# Altium schematic sheet Connectors.SchDoc
size A4; SheetNumber: 3; SheetTotal: 6
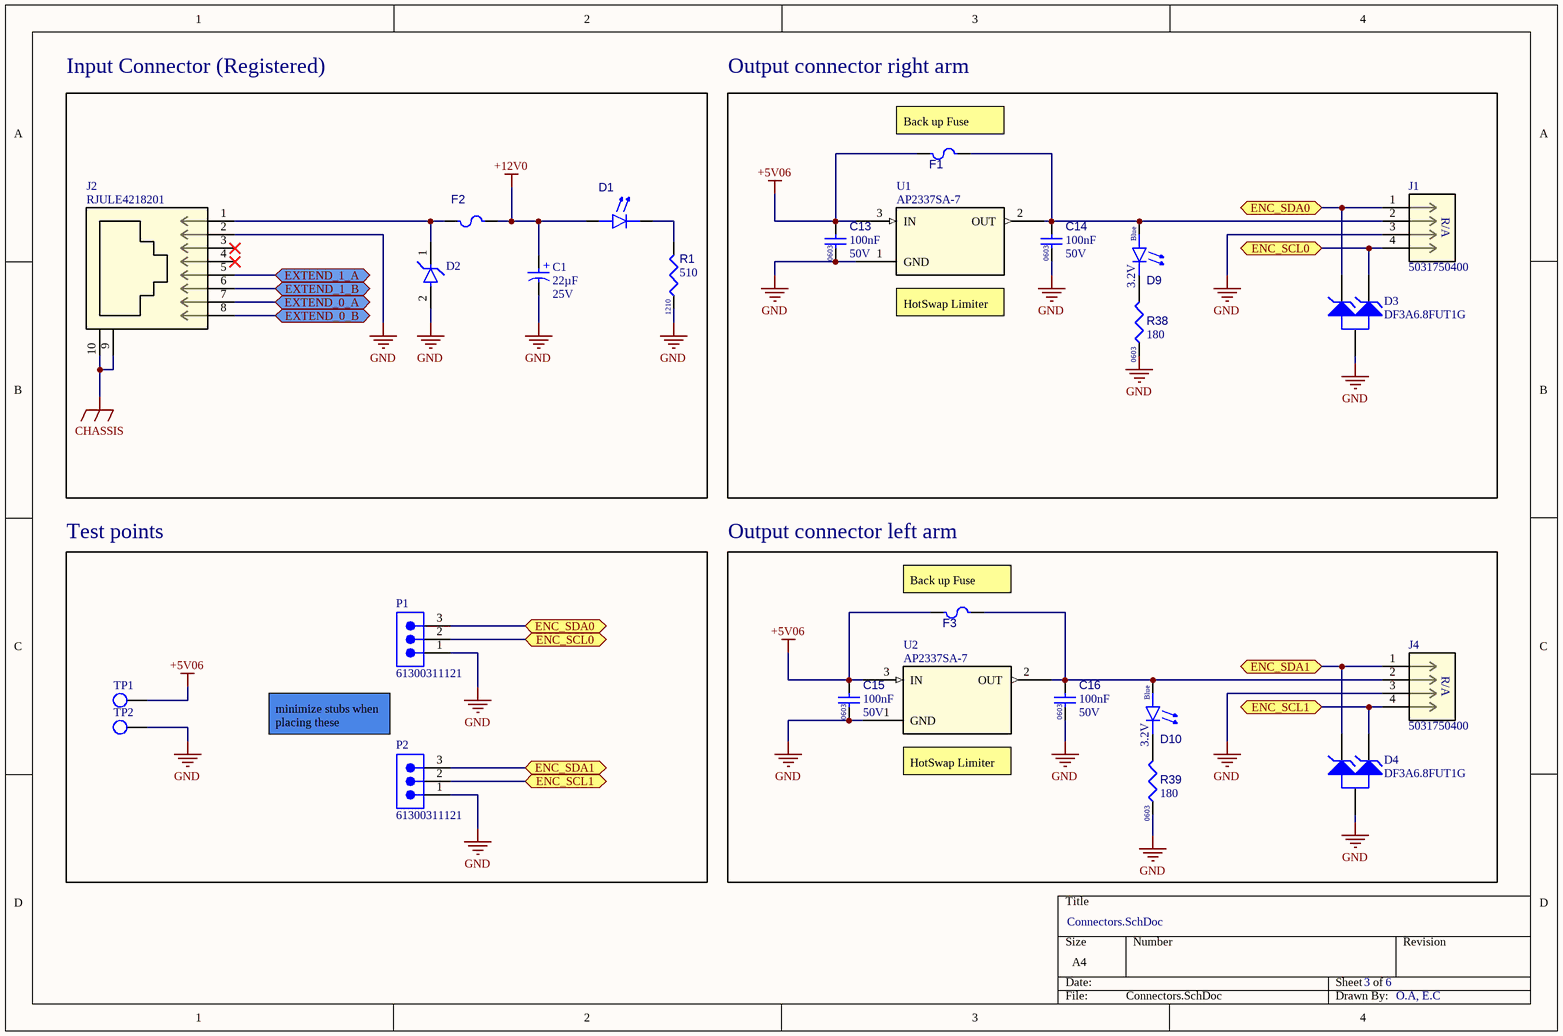
[diagram p0: Connectors.SchDoc]

## Parts
C1  value 22µF  Voltage Rating: 25V  [WCAP-PSLP_D6.3H5.8]  (hidden comment: 875105544003)
C13  value 100nF  Voltage Rating: 50V  Case/Package: 0603  [CAPC1608X90X40NL10T20]  (hidden comment: Capacitor 100 nF +/-10% 50 V 0603)
C14  value 100nF  Voltage Rating: 50V  Case/Package: 0603  [CAPC1608X90X40NL10T20]  (hidden comment: Capacitor 100 nF +/-10% 50 V 0603)
C15  value 100nF  Voltage Rating: 50V  Case/Package: 0603  [CAPC1608X90X40NL10T20]  (hidden comment: Capacitor 100 nF +/-10% 50 V 0603)
C16  value 100nF  Voltage Rating: 50V  Case/Package: 0603  [CAPC1608X90X40NL10T20]  (hidden comment: Capacitor 100 nF +/-10% 50 V 0603)
D1  150060RS75000  [WL-SMCW_0603_150060xx75000]  (value not drawn)
D2  SMAJ5.0A-13-F  [FP-SMA-MFG]  (value not drawn)
D3  DF3A6.8FUT1G  [ONSC-SC-70-3-419-04_V]
D4  DF3A6.8FUT1G  [ONSC-SC-70-3-419-04_V]
D9  Nominal Vf: 3.2V  Color: Blue  [WL-SMCW_0603_150060xx75000]  (hidden comment: 150060BS75000)
D10  Nominal Vf: 3.2V  Color: Blue  [WL-SMCW_0603_150060xx75000]  (hidden comment: 150060BS75000)
F1  MF-PSMF050X-2  [FP-MF-PSMF-MFG]  (value not drawn)
F2  MF-MSMF075-2  [BOUR-MF-MSMF050-2_V]  (value not drawn)
F3  MF-PSMF050X-2  [FP-MF-PSMF-MFG]  (value not drawn)
J1  5031750400  [5031750400-Footprint-1]
J2  RJULE4218201  [RJULE4218201-Footprint-1]
J4  5031750400  [5031750400-Footprint-1]
P1  61300311121  [61300311121]
P2  61300311121  [61300311121]
R1  value 510  Case/Package: 1210  [RESC3126X60X50NL10T20]  (hidden comment: RC1210JR-07510RL)
R38  value 180  Case/Package: 0603  [RESC0603(1608)_N]  (hidden comment: RC0603JR-07180RL)
R39  value 180  Case/Package: 0603  [RESC0603(1608)_N]  (hidden comment: RC0603JR-07180RL)
TP1  RCUCTE  [FP-S2761-46R-MFG]  (value not drawn)
TP2  RCUCTE  [FP-S2761-46R-MFG]  (value not drawn)
U1  AP2337SA-7  [SOT90P240X120-3L]
U2  AP2337SA-7  [SOT90P240X120-3L]

## Blocks framed on the sheet
Input Connector (Registered): C1 D1 D2 F2 J2 R1
Output connector right arm: C13 C14 D3 D9 F1 J1 R38 U1
Test points: P1 P2 TP1 TP2
Output connector left arm: C15 C16 D4 D10 F3 J4 R39 U2

## Ports
ENC_SCL0 (bidir), ENC_SCL1 (bidir), ENC_SDA0 (bidir), ENC_SDA1 (bidir), EXTEND_0_A (bidir), EXTEND_0_B (bidir), EXTEND_1_A (bidir), EXTEND_1_B (bidir)

## Nets
+5V06: C13.2 C15.2 F1.2 F3.2 TP1.1 U1.3(IN) U2.3(IN)
+12V0: C1.1(P) D1.2(A) F2.2
CHASSIS: J2.9 J2.10
GND: C1.2(N) C13.1 C14.1 C15.1 C16.1 D2.2(A) D3.3(A) D4.3(A) J1.3 J2.2 J4.3 P1.1 P2.1 R1.1 R38.1 R39.1 TP2.1 U1.1(GND) U2.1(GND)
ENC_SCL0: D3.2(K2) J1.4 P1.2 ; port ENC_SCL0
ENC_SCL1: D4.2(K2) J4.4 P2.2 ; port ENC_SCL1
ENC_SDA0: D3.1(K1) J1.1 P1.3 ; port ENC_SDA0
ENC_SDA1: D4.1(K1) J4.1 P2.3 ; port ENC_SDA1
EXTEND_0_A: J2.7 ; port EXTEND_0_A
EXTEND_0_B: J2.8 ; port EXTEND_0_B
EXTEND_1_A: J2.5 ; port EXTEND_1_A
EXTEND_1_B: J2.6 ; port EXTEND_1_B
NetC14_2: C14.2 D9.2(A) F1.1 J1.2 U1.2(OUT)
NetC16_2: C16.2 D10.2(A) F3.1 J4.2 U2.2(OUT)
NetD1_1: D1.1(K) R1.2
NetD2_1: D2.1(C) F2.1 J2.1
NetD9_1: D9.1(K) R38.2
NetD10_1: D10.1(K) R39.2

Not connected (* = marked no-connect by the designer): J2 3* 4*

## Notes on the sheet
- (near F1) Back up Fuse
- (near U1) HotSwap Limiter
- (near F3) Back up Fuse
- minimize stubs when placing these
- (near U2) HotSwap Limiter
- O.A, E.C
- (in symbol CMP-001-00085-2) +
- (in symbol CMP-002-00074-2) R/A

## Library data of the parts
C1 = CMP-001-00085-2: 22 µF 25 V Aluminum - Polymer Capacitors Radial, Can - SMD 30mOhm 2000 Hrs @ 105°C; Tolerance: 20%; Capacitor Type: Aluminium; Pins: 2; RoHS Compliant: Yes
C13-C16 = CMP-001-00017-8: Chip Capacitor, 100 nF, +/- 10%, 50 V, 0603 (1608 Metric); Capacitor Type: Ceramic; Tolerance: 10%; Mounting Technology: SM; Max Operating Temperature: 125°C; RoHS Compliant: True; Pins: 2; Min Operating Temperature: -55°C
D1 = CMP-007-00036-1: Single Color LED, Red, Water Clear, 1.1mm; Forward Current: 30mA; Max Operating Temperature: 85°C; Mounting Technology: Surface Mount; RoHS Compliant: Yes; Pins: 2; Min Operating Temperature: -40°C
D2 = CMP-004-00031-3: Trans Voltage Suppressor Diode, 400W, 5V V(RWM), Unidirectional, 1 Element, Silicon; RoHS Compliant: Yes; Max Operating Temperature: 150°C; Min Operating Temperature: -55°C; Pins: 2
D3 D4 = CMP-004-00039-1: Trans Voltage Suppressor Diode, 150W, Unidirectional, 2 Element, Silicon; Dynamic Impedance-Max: 50R; Time @ Peak Reflow Temperature-Max (s): 40s; Test Current: 5mA; Max Power Dissipation: 200mW; Package Body Material: Plastic; Number of Elements: 2; Voltage Tol-Max: 5.9%; Max Breakdown Voltage: 7.2V; Qualification Status: Not Qualified; Min Breakdown Voltage: 6.4V; Reference Voltage-Nom: 6.8V; Terminal Form: Gull Wing; Reach SVHC Compliant: Yes; Package Shape: Rectangular; Terminal Finish: Tin; Terminal Position: DUAL; JESD-609 Code: e3; Non-rep Peak Rev Power Dis-Max: 150W; Surface Mount: Yes; Diode Type: TRANS VOLTAGE SUPPRESSOR; Technology: ZENER; Polarity: Unidirectional; Max Operating Temperature: 150°C; Moisture Sensitivity Level: 1; Diode Element Material: SILICON; Min Operating Temperature: -55°C; Package Style: SMALL OUTLINEMeter; Pins: 3; Peak Reflow Temperature (Cel): 260°C; JESD-30 Code: R-PDSO-G3; RoHS Compliant: Yes
D9 D10 = CMP-007-00037-2: Single Color LED, Blue, Water Clear, 1.1mm; Channels: 1; Luminous Intensity-Nom: 145mcd; Overall Height: 0.7mm; Shape: Rectangular; Viewing Angle: 140°; Forward Current: 30mA; Pins: 2; Lens Style: WATER CLEAR; Mounting Technology: Surface Mount; Optoelectronic Device Type: SINGLE COLOR LED; Packaging: Tape and Reel; RoHS Compliant: Yes; Colour: Blue; Terminal Pitch: 1.6mm; Min Operating Temperature: -40°C; Size: 1.1mm; Reach SVHC Compliant: Yes; Max Operating Temperature: 85°C
F1 F3 = CMP-005-00014-1: PTC Resettable Fuse, 6V, Surface Mount; Power: 500mW; Thermistor Application: OVERLOAD PROTECTION; Min Operating Temperature: -40°C; Pins: 2; Reach SVHC Compliant: Yes; Resistor Type: PTC RESETTABLE FUSE; JESD-609 Code: e4; RoHS Compliant: Yes; Packaging: Tape and Reel; Max Operating Temperature: 85°C; Package Shape: Rectangular; Mounting Technology: Surface Mount; Termination: Wraparound; Terminal Placement: Dual Ended; Terminal Finish: Nickel; Rated AC Voltage (URac): 6V
F2 = CMP-005-00013-2: PTC Resettable Fuse, 13.2V, Surface Mount; Reference Standard: AEC-Q200; Thermistor Application: OVERLOAD PROTECTION; Package Length: 4.73mm; Package Width: 3.41mm; Package Height: 0.85mm; Power: 800mW; Rated Temperature: 85°C; Min Operating Temperature: -40°C; Rated AC Voltage (URac): 13.2V; Terminal Finish: Nickel; Termination: Wraparound; Packaging: Tape and Reel; Package Shape: Rectangular; Resistor Type: PTC RESETTABLE FUSE; Max Operating Temperature: 85°C; Reach SVHC Compliant: Yes; Pins: 2; JESD-609 Code: e4; RoHS Compliant: Yes; Terminal Placement: Dual Ended; Mounting Technology: Surface Mount; Package Style: SMTMeter
J1 J4 = CMP-002-00074-2: DIP Connector, 4 Contact(s), 2 Row(s), Female, Right Angle, 0.059 inch Pitch, Solder Terminal, Locking, Beige Insulator, Receptacle; Connector Type: DIP; Min Operating Temperature: -85°C; Mounting Technology: Board; RoHS Compliant: Yes; Max Operating Temperature: 85°C
J2 = CMP-002-00075-4: Modular Jack - Right Angle, Input Output Connectors RJ45, 8P8C, Without LEDs, Shield.
P1 P2 = CMP-002-00076-1: Board Connector, 3 Contact(s), 1 Row(s), Male, Straight, 0.1 inch Pitch, Solder Terminal, Locking, Black Insulator, Plug; Min Operating Temperature: -40°C; Connector Type: BOARD CONNECTOR; RoHS Compliant: Yes; Mounting Technology: Board; Max Operating Temperature: 125°C
R1 = CMP-009-00179-1: Fixed Resistor, Metal Glaze/thick Film, 0.5W, 510ohm, 200V, 5% +/-Tol, 100ppm/Cel, Surface Mount, 1210; Power: 500mW; Pins: 2; Min Operating Temperature: -55°C; Mounting Technology: Surface Mount; Max Operating Temperature: 155°C; RoHS Compliant: Yes; Tolerance: 5%
R38 R39 = CMP-009-00178-1: Fixed Resistor, Metal Glaze/thick Film, 0.1W, 180ohm, 75V, 5% +/-Tol, 100ppm/Cel, Surface Mount, 0603; Power: 100mW; Tolerance: 5%; Pins: 2; Mounting Technology: Surface Mount; RoHS Compliant: Yes; Max Operating Temperature: 155°C; Min Operating Temperature: -55°C
TP1 TP2 = CMP-002-00072-5: Test point; Connector Type: Interconnection Device; Pins: 2; Max Operating Temperature: 125°C; Case/Package: 0603; Mounting Technology: Surface Mount; RoHS Compliant: Yes; Min Operating Temperature: -55°C
U1 U2 = CMP-015-00012-4: Power Supply Support Circuit, Fixed, 1 Channel, PDSO3; Adjustable Threshold: No; Qualification Status: Not Qualified; Max Supply Voltage: 5.5V; Channels: 1; Min Supply Voltage: 2.7V; Package Body Material: Plastic; Time @ Peak Reflow Temperature-Max (s): 40s; Nominal Supply Voltage: 5V; Peak Reflow Temperature (Cel): 260°C; JESD-609 Code: e3; Length: 2.9mm; Surface Mount: Yes; Case/Package: SOP; Package Shape: Rectangular; RoHS Compliant: Yes; Moisture Sensitivity Level: 1; Temperature Grade: INDUSTRIAL; Number of Channels: 1; Package Style: SMALL OUTLINEMeter; Width: 1.3mm; Max Operating Temperature: 85°C; JESD-30 Code: R-PDSO-G3; Height - Seated (Max): 1.2mm; Terminal Position: DUAL; Pins: 3; Min Operating Temperature: -40°C; Terminal Finish: Tin; Throw Configuration: POWER SUPPLY SUPPORT CIRCUIT; Reach SVHC Compliant: Yes; Terminal Pitch: 0.915mm; Terminal Form: Gull Wing